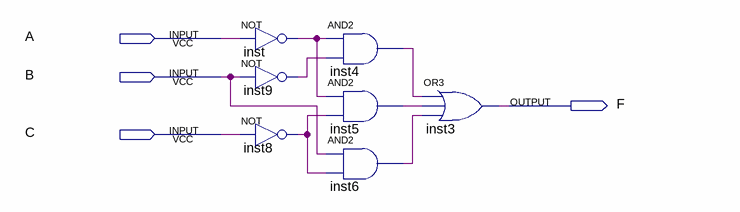
[diagram p0: schematic sheet]
// Quartus schematic main.bdf as structural Verilog: 7 symbols, 4 pins
module main (
  input  A,
  input  B,
  input  C,
  output F
);

  wire inst4_out, inst5_out, inst6_out, inst8_out, inst9_out, inst_out;

  not inst (inst_out, A);
  not inst9 (inst9_out, B);
  not inst8 (inst8_out, C);
  and inst4 (inst4_out, inst_out, inst9_out);
  and inst5 (inst5_out, inst_out, inst8_out);
  and inst6 (inst6_out, B, inst8_out);
  or inst3 (F, inst4_out, inst5_out, inst6_out);
endmodule
